# Altium schematic sheet Power.SchDoc
size A4; Revision: C.2(PCB.SCH)
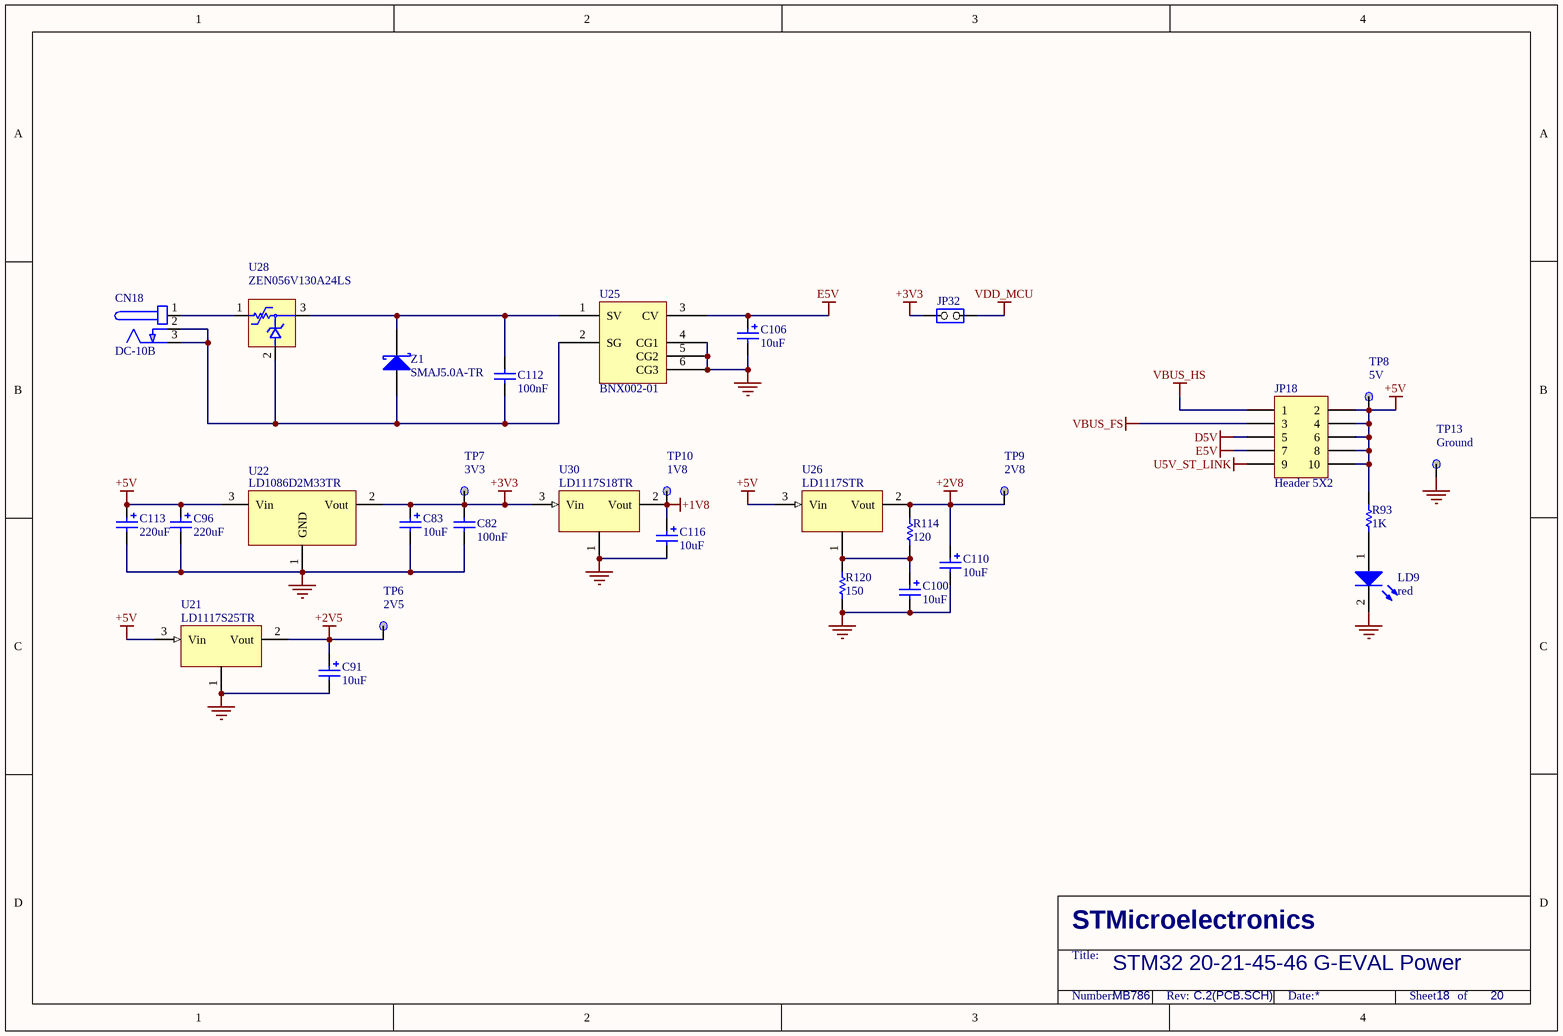
[diagram p0: Power.SchDoc]

## Parts
C82  100nF  [0402C]
C83  10uF  [TAN-A]
C91  10uF  [TAN-A]
C96  220uF  [C310M-6]
C100  10uF  [TAN-A]
C106  10uF  [C160M-5.5]
C110  10uF  [TAN-A]
C112  100nF  [0402C]
C113  220uF  [C310M-6]
C116  10uF  [TAN-A]
CN18  DC-10B  [DC10B]
JP18  Header 5X2  [HDR2X5]
JP32  (no value)  [SIP2]
LD9  red  [0603D]
R93  1K  [0603R]
R114  120  [0603R]
R120  150  [0603R]
TP6  2V5  [TP]
TP7  3V3  [TP]
TP8  5V  [TP]
TP9  2V8  [TP]
TP10  1V8  [TP]
TP13  Ground  [TP]
U21  LD1117S25TR  [SOT-223]
U22  LD1086D2M33TR  [D2PAK/A]
U25  BNX002-01  [BNX001]
U26  LD1117STR  [SOT-223]
U28  ZEN056V130A24LS  [polyzen]
U30  LD1117S18TR  [SOT-223]
Z1  SMAJ5.0A-TR  [1R1C]

## Nets
+1V8: C116.1 TP10.1 U30.2(Vout)
+2V5: C91.1 TP6.1 U21.2(Vout)
+2V8: C110.1 R114.1 TP9.1 U26.2(Vout)
+3V3: C82.1 C83.1 JP32.1(COMMON) TP7.1 U22.2(Vout) U30.3(Vin)
+5V: C96.1 C113.1 JP18.2 JP18.4 JP18.6 JP18.8 JP18.10 R93.2 TP8.1 U21.3(Vin) U22.3(Vin) U26.3(Vin)
D5V: JP18.5
E5V: C106.1 JP18.7 U25.3(CV)
GND: C82.2 C83.2 C91.2 C96.2 C100.2 C106.2 C110.2 C113.2 C116.2 LD9.2(K) R120.2 TP13.1 U21.1 U22.1(GND) U25.4(CG1) U25.5(CG2) U25.6(CG3) U30.1
U5V_ST_LINK: JP18.9
VBUS_FS: JP18.3
VBUS_HS: JP18.1
VDD_MCU: JP32.2(NO)
NetC100_1: C100.1 R114.2 R120.1 U26.1
NetC112_1: C112.1 U25.1(SV) U28.3 Z1.2(K)
NetC112_2: C112.2 CN18.2(GND) CN18.3(GND) U25.2(SG) U28.2 Z1.1(A)
NetCN18_1: CN18.1(+) U28.1
NetLD9_1: LD9.1(A) R93.1

## Notes on the sheet
- STM32 20-21-45-46 G-EVAL Power
- MB786
- 18
- 20
- STMicroelectronics
- Title:
- Number:
- Rev:
- Date:
- Sheet       of

## Library data of the parts
C82 = Cap: Capacitor; Value: 10nF; Published: 8-Jun-2000; Revision: July-2002: Re-released for DXP Platform.; Publisher: Altium Limited
C83 C91 C100 C110 C116 = Cap Pol1: Polarized Capacitor (Radial); Published: 8-Jun-2000; Revision: July-2002: Re-released for DXP Platform.; Publisher: Altium Limited; Value: 10uF
C96 C113 = Cap Pol1: Polarized Capacitor (Radial); Value: 10uF; Published: 8-Jun-2000; Revision: July-2002: Re-released for DXP Platform.; Publisher: Altium Limited
C106 = Cap Pol1: Polarized Capacitor (Radial); Value: 47uF; Published: 8-Jun-2000; Revision: July-2002: Re-released for DXP Platform.; Publisher: Altium Limited
C112 = CAP: Capacitor; Value: 100pF; Published: 8-Jun-2000; Revision: July-2002: Re-released for DXP Platform.; Publisher: Altium Limited
CN18 = PJ202A
JP18 = Header 5X2: Header, 5-Pin, Dual row; Revision: 17-Jul-2002: Re-released for DXP Platform.; Publisher: Altium Limited
JP32 = JP2
LD9 = LED2: Typical RED, GREEN, YELLOW, AMBER GaAs LED; Published: 8-Jun-2000; Revision: July-2002: Re-released for DXP Platform.; Publisher: Altium Limited
R93 = res1: Resistor; Published: 8-Jun-2000; Revision: July-2002: Re-released for DXP Platform.; Publisher: Altium Limited; Value: 1K
R114 R120 = res1: Resistor; Value: 1K; Published: 8-Jun-2000; Revision: July-2002: Re-released for DXP Platform.; Publisher: Altium Limited
TP6-TP10 TP13 = TP
U21 U26 U30 = LD1117
U22 = VOLTREG1
U25 = BNX002
Z1 = D Schottky: Schottky Diode; Code - JEDEC: DO-214-AA; Published: 8-Jun-2000; Revision: July-2002: Re-released for DXP Platform.; Publisher: Altium Limited